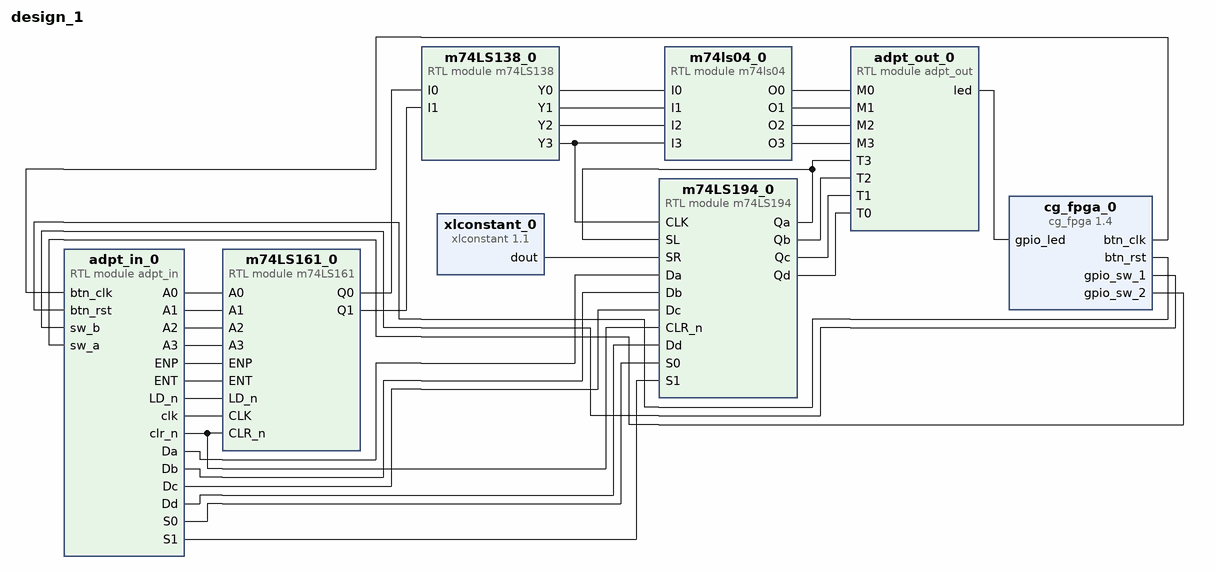
[diagram p0: block diagram of the top level]
# Vivado block design design_1, xc7z020clg400-1, Vivado 2024.2
create_bd_design design_1

create_bd_cell -type ip -vlnv educg.net:user:cg_fpga:1.4 cg_fpga_0
create_bd_cell -type module -reference adpt_in adpt_in_0
create_bd_cell -type module -reference m74LS194 m74LS194_0
create_bd_cell -type module -reference adpt_out adpt_out_0
create_bd_cell -type module -reference m74LS138 m74LS138_0
create_bd_cell -type module -reference m74LS161 m74LS161_0
create_bd_cell -type module -reference m74ls04 m74ls04_0
create_bd_cell -type ip -vlnv xilinx.com:ip:xlconstant:1.1 xlconstant_0
set_property -dict {CONFIG.CONST_VAL 0} [get_bd_cells xlconstant_0]

# ---- connections ----

connect_bd_net [get_bd_pins adpt_in_0/A0] [get_bd_pins m74LS161_0/A0]
connect_bd_net [get_bd_pins adpt_in_0/A1] [get_bd_pins m74LS161_0/A1]
connect_bd_net [get_bd_pins adpt_in_0/A2] [get_bd_pins m74LS161_0/A2]
connect_bd_net [get_bd_pins adpt_in_0/A3] [get_bd_pins m74LS161_0/A3]
connect_bd_net [get_bd_pins adpt_in_0/Da] [get_bd_pins m74LS194_0/Da]
connect_bd_net [get_bd_pins adpt_in_0/Db] [get_bd_pins m74LS194_0/Db]
connect_bd_net [get_bd_pins adpt_in_0/Dc] [get_bd_pins m74LS194_0/Dc]
connect_bd_net [get_bd_pins adpt_in_0/Dd] [get_bd_pins m74LS194_0/Dd]
connect_bd_net [get_bd_pins adpt_in_0/ENP] [get_bd_pins m74LS161_0/ENP]
connect_bd_net [get_bd_pins adpt_in_0/ENT] [get_bd_pins m74LS161_0/ENT]
connect_bd_net [get_bd_pins adpt_in_0/LD_n] [get_bd_pins m74LS161_0/LD_n]
connect_bd_net [get_bd_pins adpt_in_0/S0] [get_bd_pins m74LS194_0/S0]
connect_bd_net [get_bd_pins adpt_in_0/S1] [get_bd_pins m74LS194_0/S1]
connect_bd_net [get_bd_pins adpt_in_0/clk] [get_bd_pins m74LS161_0/CLK]
connect_bd_net [get_bd_pins adpt_in_0/clr_n] [get_bd_pins m74LS194_0/CLR_n] [get_bd_pins m74LS161_0/CLR_n]
connect_bd_net [get_bd_pins adpt_out_0/led] [get_bd_pins cg_fpga_0/gpio_led]
connect_bd_net [get_bd_pins cg_fpga_0/btn_clk] [get_bd_pins adpt_in_0/btn_clk]
connect_bd_net [get_bd_pins cg_fpga_0/btn_rst] [get_bd_pins adpt_in_0/btn_rst]
connect_bd_net [get_bd_pins cg_fpga_0/gpio_sw_1] [get_bd_pins adpt_in_0/sw_b]
connect_bd_net [get_bd_pins cg_fpga_0/gpio_sw_2] [get_bd_pins adpt_in_0/sw_a]
connect_bd_net [get_bd_pins m74LS138_0/Y0] [get_bd_pins m74ls04_0/I0]
connect_bd_net [get_bd_pins m74LS138_0/Y1] [get_bd_pins m74ls04_0/I1]
connect_bd_net [get_bd_pins m74LS138_0/Y2] [get_bd_pins m74ls04_0/I2]
connect_bd_net [get_bd_pins m74LS138_0/Y3] [get_bd_pins m74LS194_0/CLK] [get_bd_pins m74ls04_0/I3]
connect_bd_net [get_bd_pins m74LS161_0/Q0] [get_bd_pins m74LS138_0/I0]
connect_bd_net [get_bd_pins m74LS161_0/Q1] [get_bd_pins m74LS138_0/I1]
connect_bd_net [get_bd_pins m74LS194_0/Qa] [get_bd_pins m74LS194_0/SL] [get_bd_pins adpt_out_0/T3]
connect_bd_net [get_bd_pins m74LS194_0/Qb] [get_bd_pins adpt_out_0/T2]
connect_bd_net [get_bd_pins m74LS194_0/Qc] [get_bd_pins adpt_out_0/T1]
connect_bd_net [get_bd_pins m74LS194_0/Qd] [get_bd_pins adpt_out_0/T0]
connect_bd_net [get_bd_pins m74ls04_0/O0] [get_bd_pins adpt_out_0/M0]
connect_bd_net [get_bd_pins m74ls04_0/O1] [get_bd_pins adpt_out_0/M1]
connect_bd_net [get_bd_pins m74ls04_0/O2] [get_bd_pins adpt_out_0/M2]
connect_bd_net [get_bd_pins m74ls04_0/O3] [get_bd_pins adpt_out_0/M3]
connect_bd_net [get_bd_pins xlconstant_0/dout] [get_bd_pins m74LS194_0/SR]

validate_bd_design
save_bd_design
